# Altium schematic sheet Power_LCD.SchDoc
size A; SheetNumber: 4; SheetTotal: 4
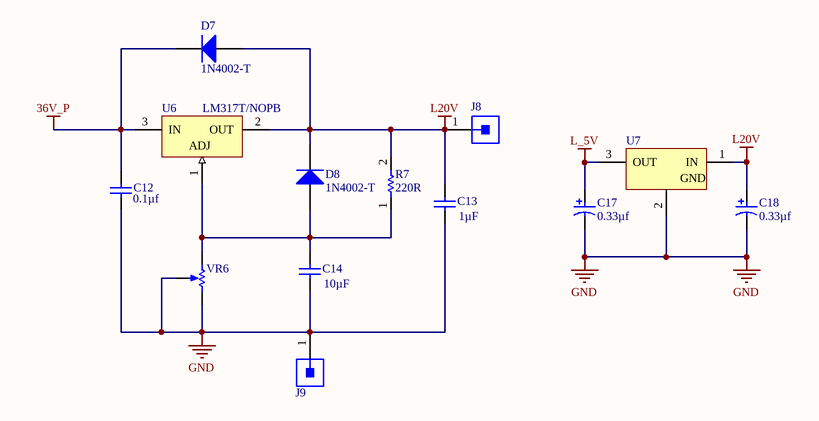
[diagram p0: Power_LCD.SchDoc]

## Parts
C12  0.1µF  [Cap-0.1uf-50V-Ceramic1]
C13  Capacitance: 1µF  [Cap-0.1uf-50v-ceramic]  (hidden comment: K104K15X7RF5TL2)
C14  Capacitance: 10µF  [Cap-0.1uf-50v-ceramic]  (hidden comment: K104K15X7RF5TL2)
C17  0.33µf  [Cap-1uf-50v-radial]
C18  0.33µf  [Cap-1uf-50v-radial]
D7  1N4002-T  [Diode-1N4002]
D8  1N4002-T  [Diode-1N4002]
J8  61300111121  [PIN-HEADER-1PIN]  (value not drawn)
J9  61300111121  [PIN-HEADER-1PIN]  (value not drawn)
R7  220R  [Resistor-1-Watt]
U6  LM317T/NOPB  [Voltage-Regulator-LM317]
U7  L7805ACV  [Voltage-Regulator-L7805ACV]  (value not drawn)
VR6  3296W-1-103LF  [Resistor-Trimmer]  (value not drawn)

## Nets
36V_P: C12.2 D7.2(K) U6.3(IN)
GND: C12.1 C13.1 C14.1 C17.2 C18.2 J9.1 U7.2(GND) VR6.2(S) VR6.3(CW)
L20V: C13.2 C18.1 D7.1(A) D8.2(K) J8.1 R7.2 U6.2(OUT) U7.1(IN)
L_5V: C17.1 U7.3(OUT)
NetC14_2: C14.2 D8.1(A) R7.1 U6.1(ADJ) VR6.1(CCW)

## Library data of the parts
C12 = Cap-0.1uf-50V-Ceramic_1: Lead Capacitor X7R_EIA_ with Capacitance: 0.10F and Rated Voltage: 50Vdc; MP: RDER71H104K0K1H03B; MF: Murata; Package: NONSTANDARD; Price: None; Availability: Unavailable; Value: 0.1µf; SnapEDA_Link: https://www.snapeda.com/parts/RDER71H104K0K1H03B/Murata/view-part/4545566/?ref=snap
C13 C14 = Cap-0.1uf-50v-ceramic: Ceramic Capacitor, 100 nF, +/- 10%, 50 V, -55 to 125 degC, 2-Pin THD, RoHS, Tape and Reel; Manufacturer: Vishay; Other Names: BC1084CT; Catalog Drawings: Mono-KapSide2-15_5.58Mono-KapSide1_15; Temperature Coefficient: X7R; Voltage - Rated: 50V; Online Catalog: Mono-Kap™Series; Size / Dimension: 0.157"Lx0.098"W(4.00mmx2.50mm); Operating Temperature: -55°C~125°C; Family: CeramicCapacitors; Manufacturer URL: http://www.vishay.com/; Standard Package: 1; Thickness (Max): -; Ratings: -; Datasheet Version: 08/2013; Package Description: 2-Pin Through Hole Device, Body 4 x 2.6 mm; Mounting Type: ThroughHole; Features: -; Lead Spacing: 0.098"(2.50mm); Tolerance: ±10%; Category: Capacitors; Mounting Technology: ThroughHole; Lead Style: Straight; Datasheet URL: http://www.vishay.com/docs/45171/kseries.pdf; Applications: GeneralPurpose; Package / Case: Radial; Height - Seated (Max): 0.220"(5.58mm); Package Reference: K104K15X7RF5TL2; Series: Mono-Kap™K; Packaging: CutTape(CT)
C17 C18 = Cap-1uf-50v-radial: Aluminum Electrolytic Capacitor, 1 uF, +/- 20%, 50 V, -55 to 105 degC, 2-Pin THD, RoHS, Bulk; Channels: 2; ComponentLink1Description: Manufacturer URL; ComponentLink2Description: Datasheet; ComponentLink2URL: https://datasheet.ciiva.com/7275/94060-7275472.pdf; PackageDescription: 2-Pin Radial Lead, Dia 5 mm, Body Length 11 mm; PackageReference: CAPPR55-200-1100X500X1200; Mount: Through Hole; Radiation Hardening: No; ComponentLink1URL: http://www.panasonic.com/; Min Operating Temperature: -30 degC; Package Quantity: 150; Max Operating Temperature: 70 degC; DatasheetVersion: Mar-05; RoHSCompliant: true; Packaging: Bulk
D7 D8 = Diode-1N4002: 1.0 A Rectifier, 15 pF, 100 V, -65 to 150 degC, 2-Pin DO-41 Plastic, RoHS, Tape and Reel; Manufacturer: Diodes Inc; Max. Average Rectified Current IO (A): 1; Max. IFSM (A): 30; CT (pF): 15; Max. IR (uA): 5; VRRM (V): 100; DatasheetVersion: Rev. 8-2; ComponentLink2Description: Datasheet; PartNumber: 1N4002-T; ComponentLink2URL: http://diodes.com/datasheets/ds28002.pdf; PackageDescription: 2-Pin Axial Lead, Body 4.635 x 2.36 mm, Lead Spread 25.4 mm; ComponentLink1Description: Manufacturer URL; RoHS: TRUE; Mounting Technology: Through Hole; Packing: Tape and Reel; Operating Temperature Range (degC): -65 to 150; VF (V): 1; ComponentLink1URL: http://diodes.com/; PackageReference: DO-41-P-2
J8 J9 = Pin-Header-1Pin: THT Vertical Pin Header WR-PHD, Pitch 2.54 mm, Single Row, 1 pins; Manufacturer: Wurth Elektronik; Gender: Male; Working Voltage: 250VAC; Withstanding Voltage: 500VAC; Pin Number: 1; Contact Resistance: 20mOhm; Rated Current: 3A; Pitch: 2.54mm; Mounting Technology: THT; Datasheet URL: https://katalog.we-online.de/em/datasheet/6130xx11121.pdf; Manufacturer URL: http://www.we-online.de; Operating Temperature: -40to105degC; Publisher: WurthElektronik; Part Number: 61300111121; Row Number: Single; Package Reference: 61300111121; Orientation: Vertical; Packaging: Bag
R7 = Resistor-1-Watt: Resistor; Manufacturer_Name: Ohmite; Manufacturer_Part_Number: OK1025E-R52; Datasheet Link: https://www.alliedelec.com/m/d/7f961050c862e52d900c42b673f6b00a.pdf; Mouser Part Number: 588-OK1025E-R52; Mouser Price/Stock: https://www.mouser.co.uk/ProductDetail/Ohmite/OK1025E-R52?qs=AkUtuiJmyfnfEYTpIxxGIg%3D%3D
U6 = Voltage-Regulator-LM317: 3-Terminal Adjustable Regulator, 3-pin TO-220, Pb-Free; Manufacturer: Texas Instruments; PackageTopMarking: NSUZXYTTE#*LM317T P+; PowerWise: N; CompType: LDO IC; ComponentLink1URL: http://www.ti.com/general/docs/lit/getliterature.tsp?genericPartNumber=LM317-N&fileType=pdf; PackageDescription: TO-220, Molded, 3 Lead, Straight; PackageReference: NDE0003A; ComponentLink1Description: Datasheet URL; RoHS: Y; PinCount: 3
U7 = Voltage-Regulator-L7805ACV: Positive Voltage Regulator, 5V, 3-Pin TO-220; DatasheetVersion: 16/11/2011; ComponentLink2Description: Datasheet; ComponentLink3Description: Package Specification; ComponentLink2URL: http://www.st.com/internet/com/TECHNICAL_RESOURCES/TECHNICAL_LITERATURE/DATASHEET/CD00000444.pdf; PackageDescription: TO, Thru-Hole, Vertical, Heatsink Mounted; 3 In-Line Leads; Pitch 2.54 mm; ComponentLink3URL: http://www.st.com/internet/com/TECHNICAL_RESOURCES/TECHNICAL_LITERATURE/PACKAGE_INFORMATION/CD00004649.pdf; PackageReference: TO220; ComponentLink1URL: http://www.st.com; PackageVersion: ver3.0; ComponentLink1Description: Manufacturer URL
VR6 = Resistor-Trimmer: Square Trimpot(R) Trimming Potentiometer, 10 KOhm, +/- 10%, 0.5 W, -55 to 125 degC, 3-Pin THD, RoHS, Tube; Voltage Rating: 75 V; Resistance: 120 Ohm; Tolerance: 1%; Power Rating: 100 mW; Case\Package: 0603; Type (Resistor): Thick Film; PackageDescription: 3-Pin Through Hole Device, Body 9.53 x 4.83 mm, Pitch 2.54 mm; RoHSCompliant: true; Package Quantity: 5000; Case Code (Metric): 1608; PackageReference: 3296W; ComponentLink2Description: Datasheet; REACH SVHC: Unknown; Case Code (Imperial): 0603; ComponentLink1URL: http://www.bourns.com/; Width: 0.85 mm; Radiation Hardening: No; Min Operating Temperature: -55 degC; Mount: Surface Mount; ComponentLink1Description: Manufacturer URL; Max Operating Temperature: 155 degC; Weight: 7.1E-05 oz; Pins: 2; DatasheetVersion: May-16; Packaging: Tape and Reel; Height: 0.45 mm; Length: 1.55 mm; ComponentLink2URL: http://www.bourns.com/docs/Product-Datasheets/3296.pdf